# Altium schematic sheet MPPT_V1.0.1_Analog.SchDoc: MPPT_V1.0
size A4; DrawnBy: Hugo Boyce; Engineer: Hugo Boyce; Organization: Altium Limited; Address1: L3, 12a Rodborough Rd; Address2: Frenchs Forest; Address3: NSW; Address4: Australia 2086; SheetNumber: 3; SheetTotal: 5
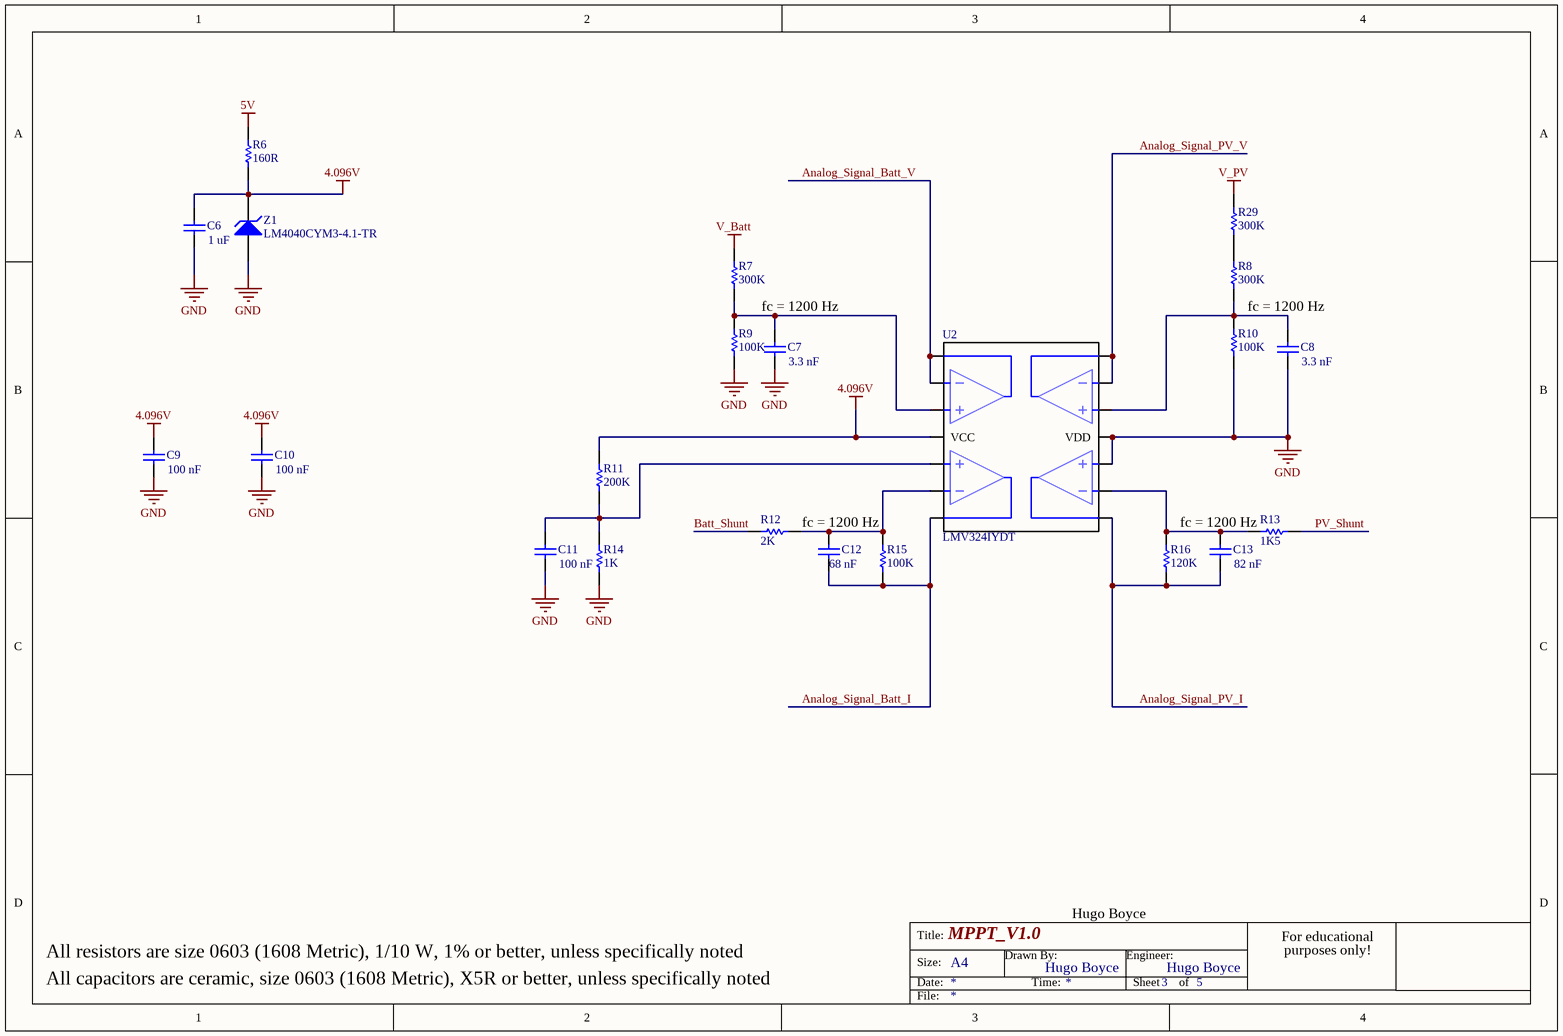
[diagram p0: MPPT_V1.0.1_Analog.SchDoc]

## Parts
C6  value 1 uF  [CAPC1608N]  (hidden comment: Cap SMD)
C7  value 3.3 nF  [CAPC1608N]  (hidden comment: Cap SMD)
C8  value 3.3 nF  [CAPC1608N]  (hidden comment: Cap SMD)
C9  value 100 nF  [CAPC1608N]  (hidden comment: Cap SMD)
C10  value 100 nF  [CAPC1608N]  (hidden comment: Cap SMD)
C11  value 100 nF  [CAPC1608N]  (hidden comment: Cap SMD)
C12  value 68 nF  [CAPC1608N]  (hidden comment: Cap SMD)
C13  value 82 nF  [CAPC1608N]  (hidden comment: Cap SMD)
R6  value 160R  [RESC1608N]  (hidden comment: Res SMD)
R7  value 300K  [RESC1608N]  (hidden comment: Res SMD)
R8  value 300K  [RESC1608N]  (hidden comment: Res SMD)
R9  value 100K  [RESC1608N]  (hidden comment: Res SMD)
R10  value 100K  [RESC1608N]  (hidden comment: Res SMD)
R11  value 200K  [RESC1608N]  (hidden comment: Res SMD)
R12  value 2K  [RESC1608N]  (hidden comment: Res SMD)
R13  value 1K5  [RESC1608N]  (hidden comment: Res SMD)
R14  value 1K  [RESC1608N]  (hidden comment: Res SMD)
R15  value 100K  [RESC1608N]  (hidden comment: Res SMD)
R16  value 120K  [RESC1608N]  (hidden comment: Res SMD)
R29  value 300K  [RESC1608N]  (hidden comment: Res SMD)
U2  LMV324IYDT  [LMV324IYDT]
Z1  LM4040CYM3-4.1-TR  [LM4040C]

## Nets
4.096V: C6.2 C9.2 C10.2 R6.1 R11.2 U2.4(VCC) Z1.1(K)
5V: R6.2
GND: C6.1 C7.1 C8.1 C9.1 C10.1 C11.1 R9.1 R10.1 R14.1 U2.10(IN+_3) U2.11(VDD) Z1.2(A)
V_Batt: R7.2
V_PV: R29.2
Analog_Signal_Batt_I: C12.1 R15.1 U2.7(OUT_2)
Analog_Signal_Batt_V: U2.1(OUT1) U2.2(IN-_1)
Analog_Signal_PV_I: C13.1 R16.1 U2.8(OUT_3)
Analog_Signal_PV_V: U2.13(IN-_4) U2.14(OUT_4)
Batt_Shunt: R12.1
PV_Shunt: R13.2
NetC7_2: C7.2 R7.1 R9.2 U2.3(IN+_1)
NetC8_2: C8.2 R8.1 R10.2 U2.12(IN+_4)
NetC11_2: C11.2 R11.1 R14.2 U2.5(IN-_2)
NetC12_2: C12.2 R12.2 R15.2 U2.6(IN+_2)
NetC13_2: C13.2 R13.1 R16.2 U2.9(IN-_3)
NetR8_2: R8.2 R29.1

## Notes on the sheet
- fc = 1200 Hz
- (near R13) fc = 1200 Hz
- All resistors are size 0603 (1608 Metric), 1/10 W, 1% or better, unless specifically noted
- All capacitors are ceramic, size 0603 (1608 Metric), X5R or better, unless specifically noted
- Title:
- Size:
- Date:
- A4
- Drawn By:
- Time:
- Engineer:
- Sheet
- of
- For educational
- purposes only!
- File:

## Library data of the parts
C6-C13 = Cap SMD: Capacitor; Published: 8-Jun-2000; LatestRevisionDate: 17-Jul-2002; LatestRevisionNote: Re-released for DXP Platform.; PackageReference: RAD-0.3; Publisher: Altium Limited; PackageDescription: Radial Cap, Thru-Hole; 2 Leads; 0.3 in Pin Spacing
R6-R16 R29 = Res SMD: Resistor; Published: 8-Jun-2000; LatestRevisionDate: 17-Jul-2002; LatestRevisionNote: Re-released for DXP Platform.; PackageReference: AXIAL-0.3; Publisher: Altium Limited; PackageDescription: Axial Device, Thru-Hole; 2 Leads; 0.3 in Pin Spacing
U2 = LMV324IYDT: IC OPAMP GP 1.3MHZ RRO 14SO; Manufacturer: STMicroelectronics; Amplifier Type: General Purpose; Output Type: Rail-to-Rail; Slew Rate: 0.45 V/µs; Current - Supply: 162µA; Voltage - Supply, Single/Dual (±): 2.7 V ~ 6 V; Supplier 1: Digi-Key; RoHS: RoHS Compliant; Category: Integrated Circuits (ICs); Stock 1: 4245; Pricing 1: 1=0.91, 10=0.779, 100=0.5821, 500=0.4573, 1000=0.35339 (CAD); Packaging: Cut Tape (CT); Part Status: Active; Operating Temperature: -40°C ~ 125°C; Mounting Type: Surface Mount; Package / Case: 14-SOIC (0.154", 3.90mm Width); Supplier Device Package: 14-SO; Base Part Number: LMV324; ComponentLink1URL: http://www.st.com/content/ccc/resource/technical/document/datasheet/b9/d8/3b/8f/a1/8f/46/01/CD00079372.pdf/files/CD00079372.pdf/jcr:content/translations/en.CD00079372.pdf; ComponentLink1Description: http://www.st.com/content/ccc/resource/technical/document/datasheet/b9/d8/3b/8f/a1/8f/46/01/CD00079372.pdf/files/CD00079372.pdf/jcr:content/translations/en.CD00079372.pdf; Supplier Part Number 1: 497-10222-1-ND; Manufacturer Part Number: LMV324IYDT
Z1 = LM4040CYM3-4.1-TR: IC VREF SHUNT 4.096V SOT23; Manufacturer: Microchip Technology; Output Type: Fixed; Tolerance: ±0.5%; Temperature Coefficient: 100ppm/°C; Noise - 10Hz to 10kHz: 80µVrms; Supplier 1: Digi-Key; RoHS: RoHS Compliant; Category: Integrated Circuits (ICs); Stock 1: 1871; Pricing 1: 1=0.5, 25=0.4032, 100=0.372 (CAD); Packaging: Cut Tape (CT); Part Status: Active; Reference Type: Shunt; Voltage - Output (Min/Fixed): 4.096V; Noise - 0.1Hz to 10Hz: -; Voltage - Input: -; Current - Supply: -; Operating Temperature: -40°C ~ 85°C (TA); Mounting Type: Surface Mount; Package / Case: TO-236-3, SC-59, SOT-23-3; Supplier Device Package: SOT-23-3; Base Part Number: LM4040; ComponentLink1URL: http://www.microchip.com/mymicrochip/filehandler.aspx?ddocname=en579040; ComponentLink1Description: http://www.microchip.com/mymicrochip/filehandler.aspx?ddocname=en579040; Supplier Part Number 1: 576-2568-1-ND; Manufacturer Part Number: LM4040CYM3-4.1-TR